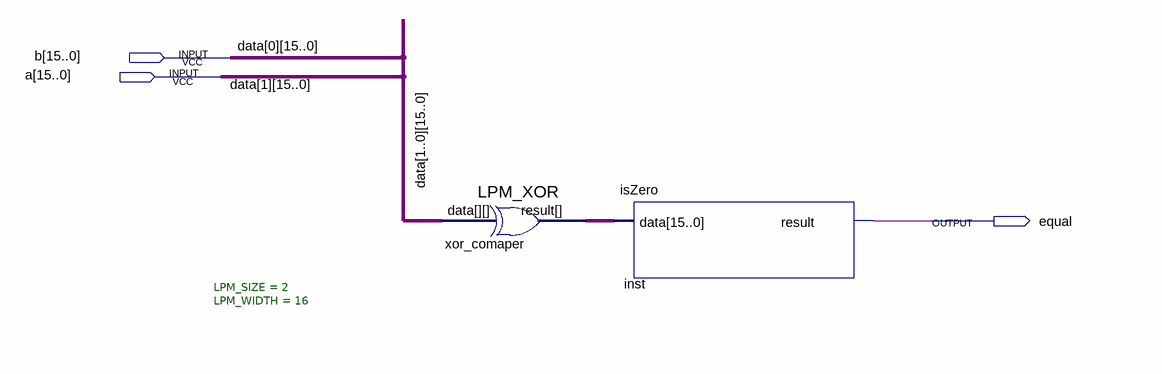
[diagram p0: schematic sheet]
// Quartus schematic comparator.bdf as structural Verilog: 2 symbols, 3 pins
module comparator (
  input  [15:0] b,
  input  [15:0] a,
  output equal
);

  wire [15:0] xor_comaper_result;

  LPM_XOR #(.LPM_SIZE(2), .LPM_WIDTH(16)) xor_comaper (.data({a, b}), .result(xor_comaper_result));
  isZero inst (.data(xor_comaper_result), .result(equal));

  // Other names for the same wires on the sheet: data_0[15:0] = b; data_1[15:0] = a
endmodule
